# Altium project Sp25-Candle_Maker.PrjPcb (part 1 of 2)
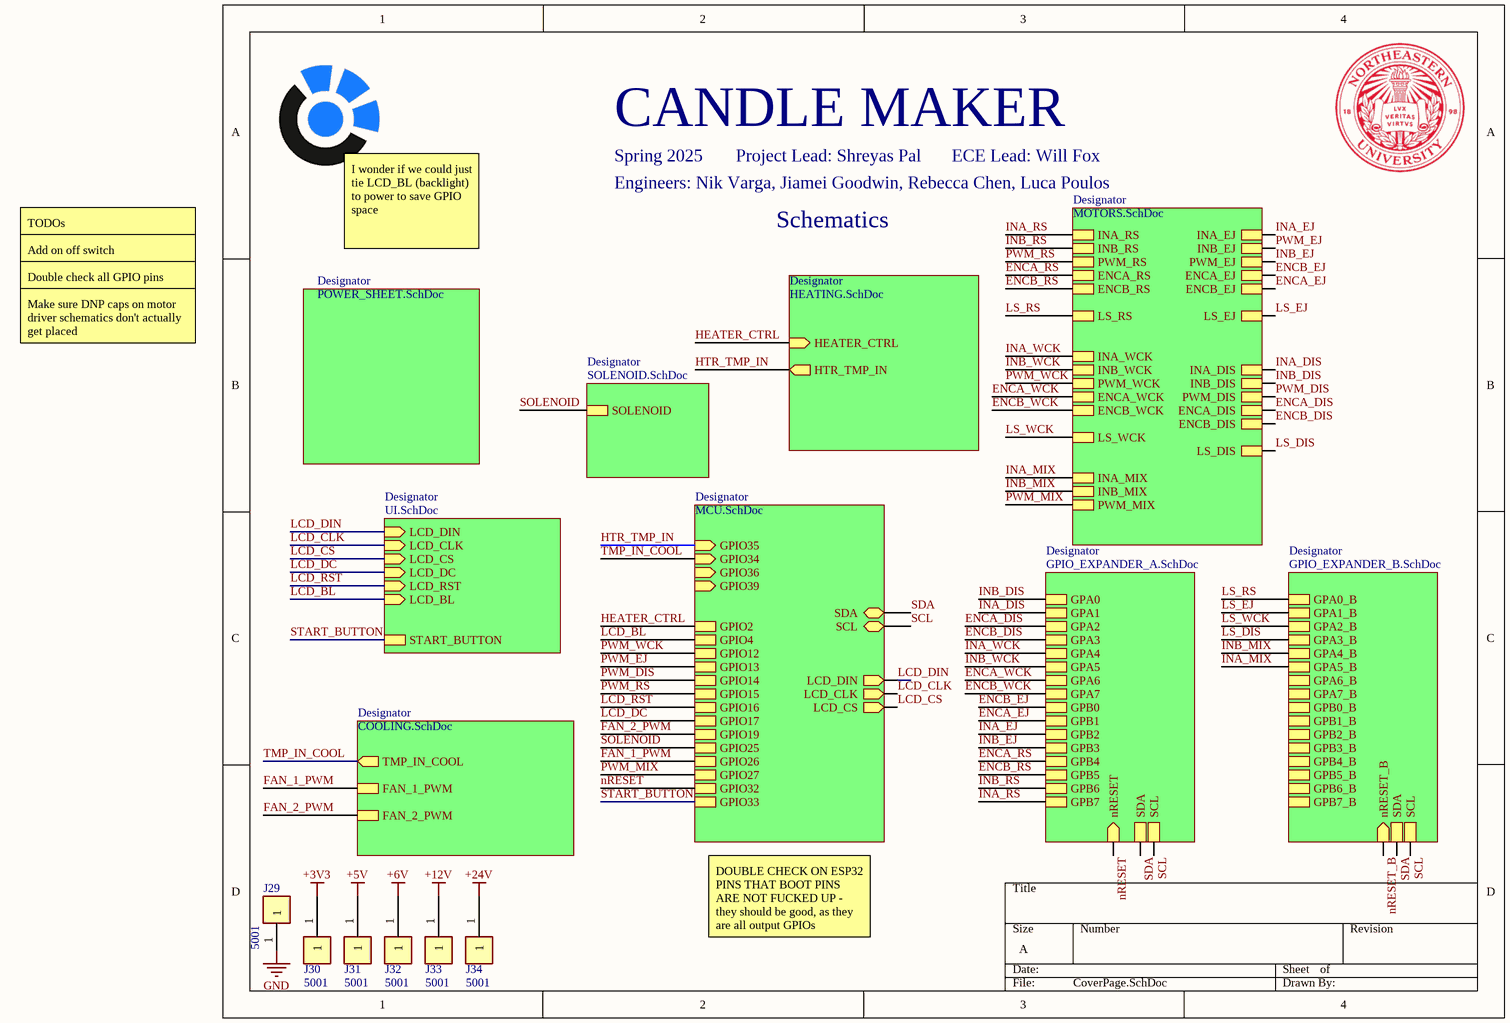
[diagram p0: CoverPage.SchDoc]
12 sheets, 196 parts. Net scope: hierarchical (ports join the sheet entries above them; power ports are global).
Board file: Candle_Main_PCB.PcbDoc
Sheets:
  CoverPage.SchDoc
    Designator = HEATING.SchDoc
    Designator = MCU.SchDoc
    Designator = MOTORS.SchDoc
      D1 = VNH5019.SchDoc
      D5 = VNH5019.SchDoc
      D4 = VNH5019.SchDoc
      D2 = VNH5019.SchDoc
      D3 = VNH5019.SchDoc
    Designator = COOLING.SchDoc
    Designator = POWER_SHEET.SchDoc
    Designator = UI.SchDoc
    Designator = GPIO_EXPANDER_A.SchDoc
    Designator = GPIO_EXPANDER_B.SchDoc
    Designator = SOLENOID.SchDoc
  LDO.SchDoc

## Sheet CoverPage.SchDoc
size A; SheetNumber: 1; SheetTotal: 12

### Parts
J29  5001  [FP-5001-MFG]
J30  5001  [FP-5001-MFG]
J31  5001  [FP-5001-MFG]
J32  5001  [FP-5001-MFG]
J33  5001  [FP-5001-MFG]
J34  5001  [FP-5001-MFG]

### Sub-sheets
Designator = HEATING.SchDoc: HEATER_CTRL (in), HTR_TMP_IN (out)
Designator = MCU.SchDoc: GPIO35 (in), SDA (bidir), SCL (bidir), LCD_DIN (out), LCD_CLK (out), LCD_CS (out), GPIO2, GPIO4, GPIO12, GPIO13, GPIO14, GPIO15, GPIO16, GPIO17, GPIO19, GPIO25, GPIO26, GPIO27, GPIO32, GPIO33, GPIO34 (in), GPIO36 (in), GPIO39 (in)
Designator = MOTORS.SchDoc: INA_RS, INB_RS, PWM_RS, ENCA_RS, ENCB_RS, LS_RS, INA_WCK, INB_WCK, PWM_WCK, ENCA_WCK, ENCB_WCK, LS_WCK, INA_MIX, INB_MIX, PWM_MIX, INA_EJ, INB_EJ, PWM_EJ, ENCA_EJ, ENCB_EJ, LS_EJ, INA_DIS, INB_DIS, PWM_DIS, ENCA_DIS, ENCB_DIS, LS_DIS
Designator = COOLING.SchDoc: TMP_IN_COOL (out), FAN_1_PWM, FAN_2_PWM
Designator = POWER_SHEET.SchDoc: no entries
Designator = UI.SchDoc: LCD_DIN (in), LCD_CLK (in), LCD_CS (in), LCD_DC (in), LCD_RST (in), LCD_BL (in), START_BUTTON
Designator = GPIO_EXPANDER_A.SchDoc: GPA0, GPA1, GPA2, GPA3, GPA4, GPA5, GPA6, GPA7, GPB0, GPB1, GPB2, GPB3, GPB4, GPB5, GPB6, GPB7, SCL, SDA, nRESET (in)
Designator = GPIO_EXPANDER_B.SchDoc: SCL, SDA, GPA0_B, GPA1_B, GPA2_B, GPA3_B, GPA4_B, GPA5_B, GPA6_B, GPA7_B, GPB0_B, GPB1_B, GPB2_B, GPB3_B, GPB4_B, GPB5_B, GPB6_B, GPB7_B, nRESET_B (in)
Designator = SOLENOID.SchDoc: SOLENOID

### Nets
+3V3: J30.1
+5V: J31.1
+6V: J32.1  [project net VOUT6]
+12V: J33.1  [project net VOUT12]
+24V: J34.1
GND: J29.1
ENCA_DIS: sheet Designator/ENCA_DIS, sheet Designator/GPA2
ENCA_EJ: sheet Designator/ENCB_EJ, sheet Designator/GPB1
ENCA_RS: sheet Designator/ENCA_RS, sheet Designator/GPB4
ENCA_WCK: sheet Designator/ENCA_WCK, sheet Designator/GPA6
ENCB_DIS: sheet Designator/ENCB_DIS, sheet Designator/GPA3
ENCB_EJ: sheet Designator/ENCA_EJ, sheet Designator/GPB0
ENCB_RS: sheet Designator/ENCB_RS, sheet Designator/GPB5
ENCB_WCK: sheet Designator/ENCB_WCK, sheet Designator/GPA7
FAN_1_PWM: sheet Designator/GPIO26, sheet Designator/FAN_1_PWM
FAN_2_PWM: sheet Designator/GPIO19, sheet Designator/FAN_2_PWM
HEATER_CTRL: sheet Designator/HEATER_CTRL, sheet Designator/GPIO2
HTR_TMP_IN: sheet Designator/HTR_TMP_IN, sheet Designator/GPIO35
INA_DIS: sheet Designator/INA_DIS, sheet Designator/GPA1
INA_EJ: sheet Designator/INA_EJ, sheet Designator/GPB2
INA_MIX: sheet Designator/INA_MIX, sheet Designator/GPA5_B
INA_RS: sheet Designator/INA_RS, sheet Designator/GPB7
INA_WCK: sheet Designator/INA_WCK, sheet Designator/GPA4
INB_DIS: sheet Designator/INB_DIS, sheet Designator/GPA0
INB_EJ: sheet Designator/PWM_EJ, sheet Designator/GPB3
INB_MIX: sheet Designator/INB_MIX, sheet Designator/GPA4_B
INB_RS: sheet Designator/INB_RS, sheet Designator/GPB6
INB_WCK: sheet Designator/INB_WCK, sheet Designator/GPA5
LCD_BL: sheet Designator/GPIO4, sheet Designator/LCD_BL
LCD_CLK: sheet Designator/LCD_CLK, sheet Designator/LCD_CLK
LCD_CS: sheet Designator/LCD_CS, sheet Designator/LCD_CS
LCD_DC: sheet Designator/GPIO17, sheet Designator/LCD_DC
LCD_DIN: sheet Designator/LCD_DIN, sheet Designator/LCD_DIN
LCD_RST: sheet Designator/GPIO16, sheet Designator/LCD_RST
LS_DIS: sheet Designator/LS_DIS, sheet Designator/GPA3_B
LS_EJ: sheet Designator/LS_EJ, sheet Designator/GPA1_B
LS_RS: sheet Designator/LS_RS, sheet Designator/GPA0_B
LS_WCK: sheet Designator/LS_WCK, sheet Designator/GPA2_B
nRESET: sheet Designator/GPIO32, sheet Designator/nRESET
nRESET_B: sheet Designator/nRESET_B
PWM_DIS: sheet Designator/GPIO14, sheet Designator/PWM_DIS
PWM_EJ: sheet Designator/GPIO13, sheet Designator/INB_EJ
PWM_MIX: sheet Designator/GPIO27, sheet Designator/PWM_MIX
PWM_RS: sheet Designator/GPIO15, sheet Designator/PWM_RS
PWM_WCK: sheet Designator/GPIO12, sheet Designator/PWM_WCK
SCL: sheet Designator/SCL, sheet Designator/SCL, sheet Designator/SCL
SDA: sheet Designator/SDA, sheet Designator/SDA, sheet Designator/SDA
SOLENOID: sheet Designator/GPIO25, sheet Designator/SOLENOID
START_BUTTON: sheet Designator/GPIO33, sheet Designator/START_BUTTON
TMP_IN_COOL: sheet Designator/GPIO34, sheet Designator/TMP_IN_COOL

### Notes on the sheet
- CANDLE MAKER
- Spring 2025
- Project Lead: Shreyas Pal
- ECE Lead: Will Fox
- TODOs
- Engineers: Nik Varga, Jiamei Goodwin, Rebecca Chen, Luca Poulos
- Schematics
- Add on off switch
- Double check all GPIO pins
- I wonder if we could just tie LCD_BL (backlight) to power to save GPIO space
- Make sure DNP caps on motor driver schematics don't actually get placed
- DOUBLE CHECK ON ESP32 PINS THAT BOOT PINS ARE NOT FUCKED UP - they should be good, as they are all output GPIOs

### Library data of the parts
J29-J34 = CMP-2000-05181-2: PC TEST POINT MINIATURE BLACK; Body Material: Bronze; Plating: Silver; Inside Diameter: 1.27mm; Hole Diameter: 1.6mm; Number of Ports: 1; Outside Diameter: 2.54mm; Insulation: Insulated; Insulation Material: Nylon; Mount: Through Hole; RoHS Compliant: Yes; Series: THM; Height: 0.3inch; Termination: Through Hole; Material: Nylon; Packaging: Bulk; Contact Material: Bronze; REACH SVHC: No SVHC; Contact Plating: Silver; Orientation: Straight; Lead Free: Lead Free; Package Quantity: 100; Length: 7.62mm; Flammability Rating: UL94 V-0; Number of Contacts: 1; Diameter: 2.54mm; Housing Color: Black; Color: Black

## Sheet HEATING.SchDoc
size A; SheetNumber: 3; SheetTotal: 12
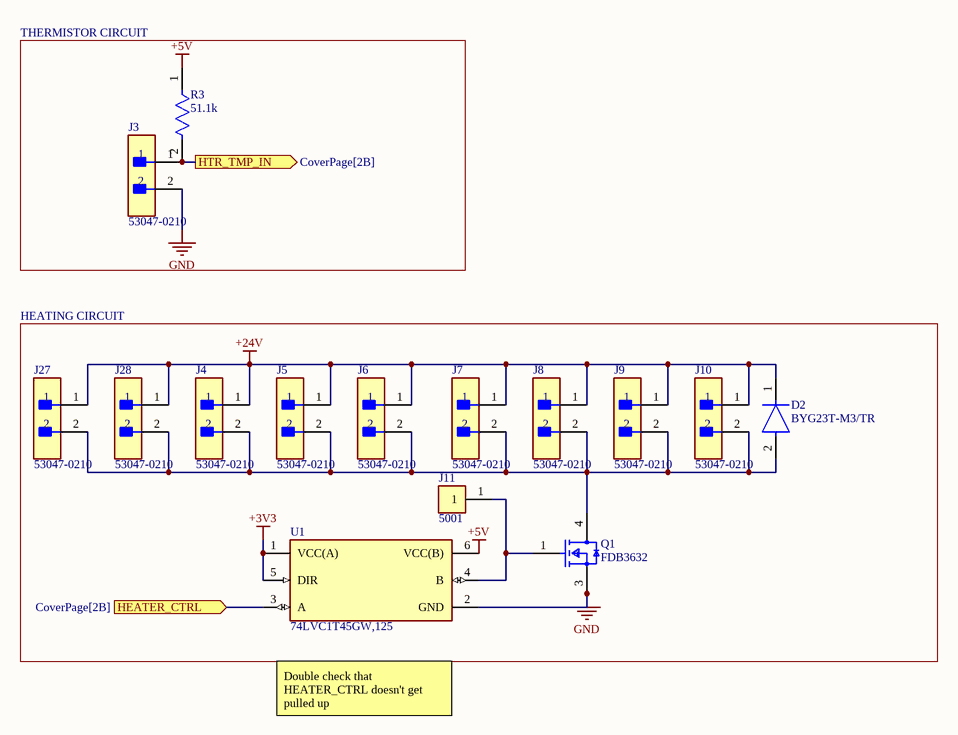
[diagram p1: HEATING.SchDoc]

### Parts
D2  BYG23T-M3/TR  [FP-SMA-MFG]
J3  53047-0210  [FP-53047-0210-MFG]
J4  53047-0210  [FP-53047-0210-MFG]
J5  53047-0210  [FP-53047-0210-MFG]
J6  53047-0210  [FP-53047-0210-MFG]
J7  53047-0210  [FP-53047-0210-MFG]
J8  53047-0210  [FP-53047-0210-MFG]
J9  53047-0210  [FP-53047-0210-MFG]
J10  53047-0210  [FP-53047-0210-MFG]
J11  5001  [FP-5001-MFG]
J27  53047-0210  [FP-53047-0210-MFG]
J28  53047-0210  [FP-53047-0210-MFG]
Q1  FDB3632  [FP-418AJ-MFG]
R3  51.1k  [FP-RG2012-MFG]
U1  74LVC1T45GW,125  [FP-SOT363-IPC_B]

### Blocks framed on the sheet
THERMISTOR CIRCUIT: J3 R3
HEATING CIRCUIT: D2 J4-J11 J27 J28 Q1 U1

### Ports
HEATER_CTRL (in, see CoverPage[2B]), HTR_TMP_IN (out, see CoverPage[2B])

### Nets
+3V3: U1.1(VCC(A)) U1.5(DIR)
+5V: R3.1 U1.6(VCC(B))
+24V: D2.1(C) J4.1 J5.1 J6.1 J7.1 J8.1 J9.1 J10.1 J27.1 J28.1
GND: J3.2 Q1.3(S) U1.2(GND)
HEATER_CTRL: U1.3(A) ; port HEATER_CTRL
HTR_TMP_IN: J3.1 R3.2 ; port HTR_TMP_IN
NetD2_2: D2.2(A) J4.2 J5.2 J6.2 J7.2 J8.2 J9.2 J10.2 J27.2 J28.2 Q1.4(D)
NetJ11_1: J11.1 Q1.1(G) U1.4(B)

### Notes on the sheet
- Double check that HEATER_CTRL doesn't get pulled up

### Library data of the parts
D2 = CMP-02540-000071-1: DIODE AVALANCHE 1300V 1A DO214AC; Element Configuration: Single; Reverse Voltage: 1.3kV; Zener Voltage: 200V; Reverse Recovery Time: 75ns; Max Forward Surge Current (Ifsm): 18A; Max Reverse Current: 5uA; Max Power Dissipation: 800mW; Forward Voltage: 1.74V; Min Operating Temperature: -55°C; Diode Type: Avalanche; Mount: Surface Mount; Series: BYG23T-M3; Radiation Hardening: No; Height: 2.29mm; Width: 2.79mm; Number of Pins: 2; Length: 4.5mm; Weight: 0.00388oz; Forward Current: 1A; Package Quantity: 1800; Recovery Time: 75ns; Peak Non-Repetitive Surge Current: 18A; Max Repetitive Reverse Voltage (Vrrm): 1.3kV; Average Rectified Current: 1A; Contact Plating: Tin; RoHS Compliant: Yes; Case/Package: SMA; Max Reverse Voltage (DC): 1.3kV; Max Operating Temperature: 150°C; Packaging: Cut Tape; Max Surge Current: 18A
J3-J10 J27 J28 = CMP-2000-05628-3: CONN HEADER VERT 2POS 1.25MM; Manufacturer: Molex; Conn Gender: Male; Voltage Rating: 125V; Conn Orientation: Vertical; Number Of Contacts: 2; Current Rating: 1A; Contact Material: Tin; Temperature Range Low: -40°C; ComponentLink2URL: http://www.molex.com/webdocs/datasheets/pdf/en-us/0530470210_PCB_HEADERS.pdf; Mouser Description: 1.25mm Pitch PicoBlade™ Wire-to-Board Header, Vertical, with Friction Lock, 2 Circuits; Manufacturer Part Number: 53047-0210; Temperature Range High: +85°C; ComponentLink2Description: Datasheet; Automotive: No; RoHS: TRUE; Ambient Temperature Range High: +85°C; Octopart: https://octopart.com/53047-0210-molex-276772; Footprint Url: https://www.molex.com/pdm_docs/sd/530470210_sd.pdf; Lead Free: Yes; Pitch: 1.25mm; Temperature: -40°C to +85°C; Device Class L2: Headers and Wire Housings; Package: 0; Ambient Temperature Range Low: -40°C; Digikey Description: CONN HEADER VERT 2POS 1.25MM; Category: Conn; Device Class L3: unset; Number Of Rows: 1; Device Class L1: Connectors; Height: 4.4mm
J11 = CMP-2000-05181-2: as J29 on sheet CoverPage; Insulation Material: Nylon; Mount: Through Hole; RoHS Compliant: Yes; Series: THM; Height: 0.3inch; Termination: Through Hole; Material: Nylon; Packaging: Bulk; Contact Material: Bronze; REACH SVHC: No SVHC; Contact Plating: Silver; Orientation: Straight; Lead Free: Lead Free; Package Quantity: 100; Length: 7.62mm; Flammability Rating: UL94 V-0; Number of Contacts: 1; Diameter: 2.54mm; Housing Color: Black; Color: Black
Q1 = CMP-07173-000068-1: MOSFET N-CH 100V 80A D2PAK; Manufacturer: ON Semiconductor; Threshold Vgs Min: 2V; Turn On Delay Time: 30ns; Reverse Recovery Charge: 120nC; Input Capacitace At Vds: 6000pF @ 25V; Max Junction Temp: +175°C; Threshold Vgs Max: 4V; Number Of Channels: 1; Drain To Source Resistance: 0.0075Ω; Power Dissipation: 310W; Reverse Recovery Time: 64ns; Rthja Max: 43°C/W; Continuous Drain Current: 12A; Depletion Mode: False; Standoff Height: 0mm; Gate To Source Voltage: 20V; Turn Off Delay Time: 96ns; Gate Charge At Vgs: 84nC @ 10V; Max Forward Diode Voltage: 1.25V; Footprint Url: https://www.onsemi.com/pub/Collateral/418AJ.PDF; Category: Trans; ComponentLink2URL: https://www.onsemi.com/pub/Collateral/FDP3632-D.PDF; Package: 418AJ; Drain To Source Voltage: 100V; ComponentLink2Description: Datasheet; Temperature Range Low: -55°C; Device Class L2: Transistors; Digikey Description: MOSFET N-CH 100V 80A D2PAK; Device Class L3: MOSFETs; Automotive: No; Drain To Source Breakdown Voltage: 100V; Octopart: https://octopart.com/fdb3632-on+semiconductor-84325670; Number Of N Channels: 1; Temperature Range High: +175°C; Device Class L1: Discrete Semiconductors; RoHS: TRUE; Lead Free: Yes; Height: 5.08mm; Manufacturer Part Number: FDB3632; Mouser Description: MOSFET N-Channel PowerTrench; Temperature: -55°C to +175°C
R3 = CMP-2001-03008-2: Automotive Metal Thin Film Chip Resistor, 0805, 51.1kΩ, 0.1%, 25ppm/°C, 0.125W, 150V; Power Rating: 125mW; Resistance: 51.1kR; Number of Terminations: 2; Case Code (Imperial): 0805; Height: 0.02inch; Min Operating Temperature: -55°C; Voltage Rating: 150V; Length: 0.079inch; Lead Free: Lead Free; Resistor Type: Thin Film; Tolerance: 0.1%; Weight: 0.000194oz; Termination: SMD/SMT; Max Power Dissipation: 125mW; Packaging: Tape and Reel; Width: 1.2mm; Series: RG; Max Operating Temperature: 155°C; Case/Package: 0805; Temperature Coefficient: 25ppm/°C; Package Quantity: 1; Case Code (Metric): 2012; RoHS Compliant: Yes; Voltage Rating (DC): 150V; Features: Automotive AEC-Q200
U1 = CMP-14347-000008-1: IC TRNSLTR BIDIRECTIONAL 6TSSOP

## Sheet MCU.SchDoc
size 381 x 241 mm; SheetNumber: 4; SheetTotal: 12
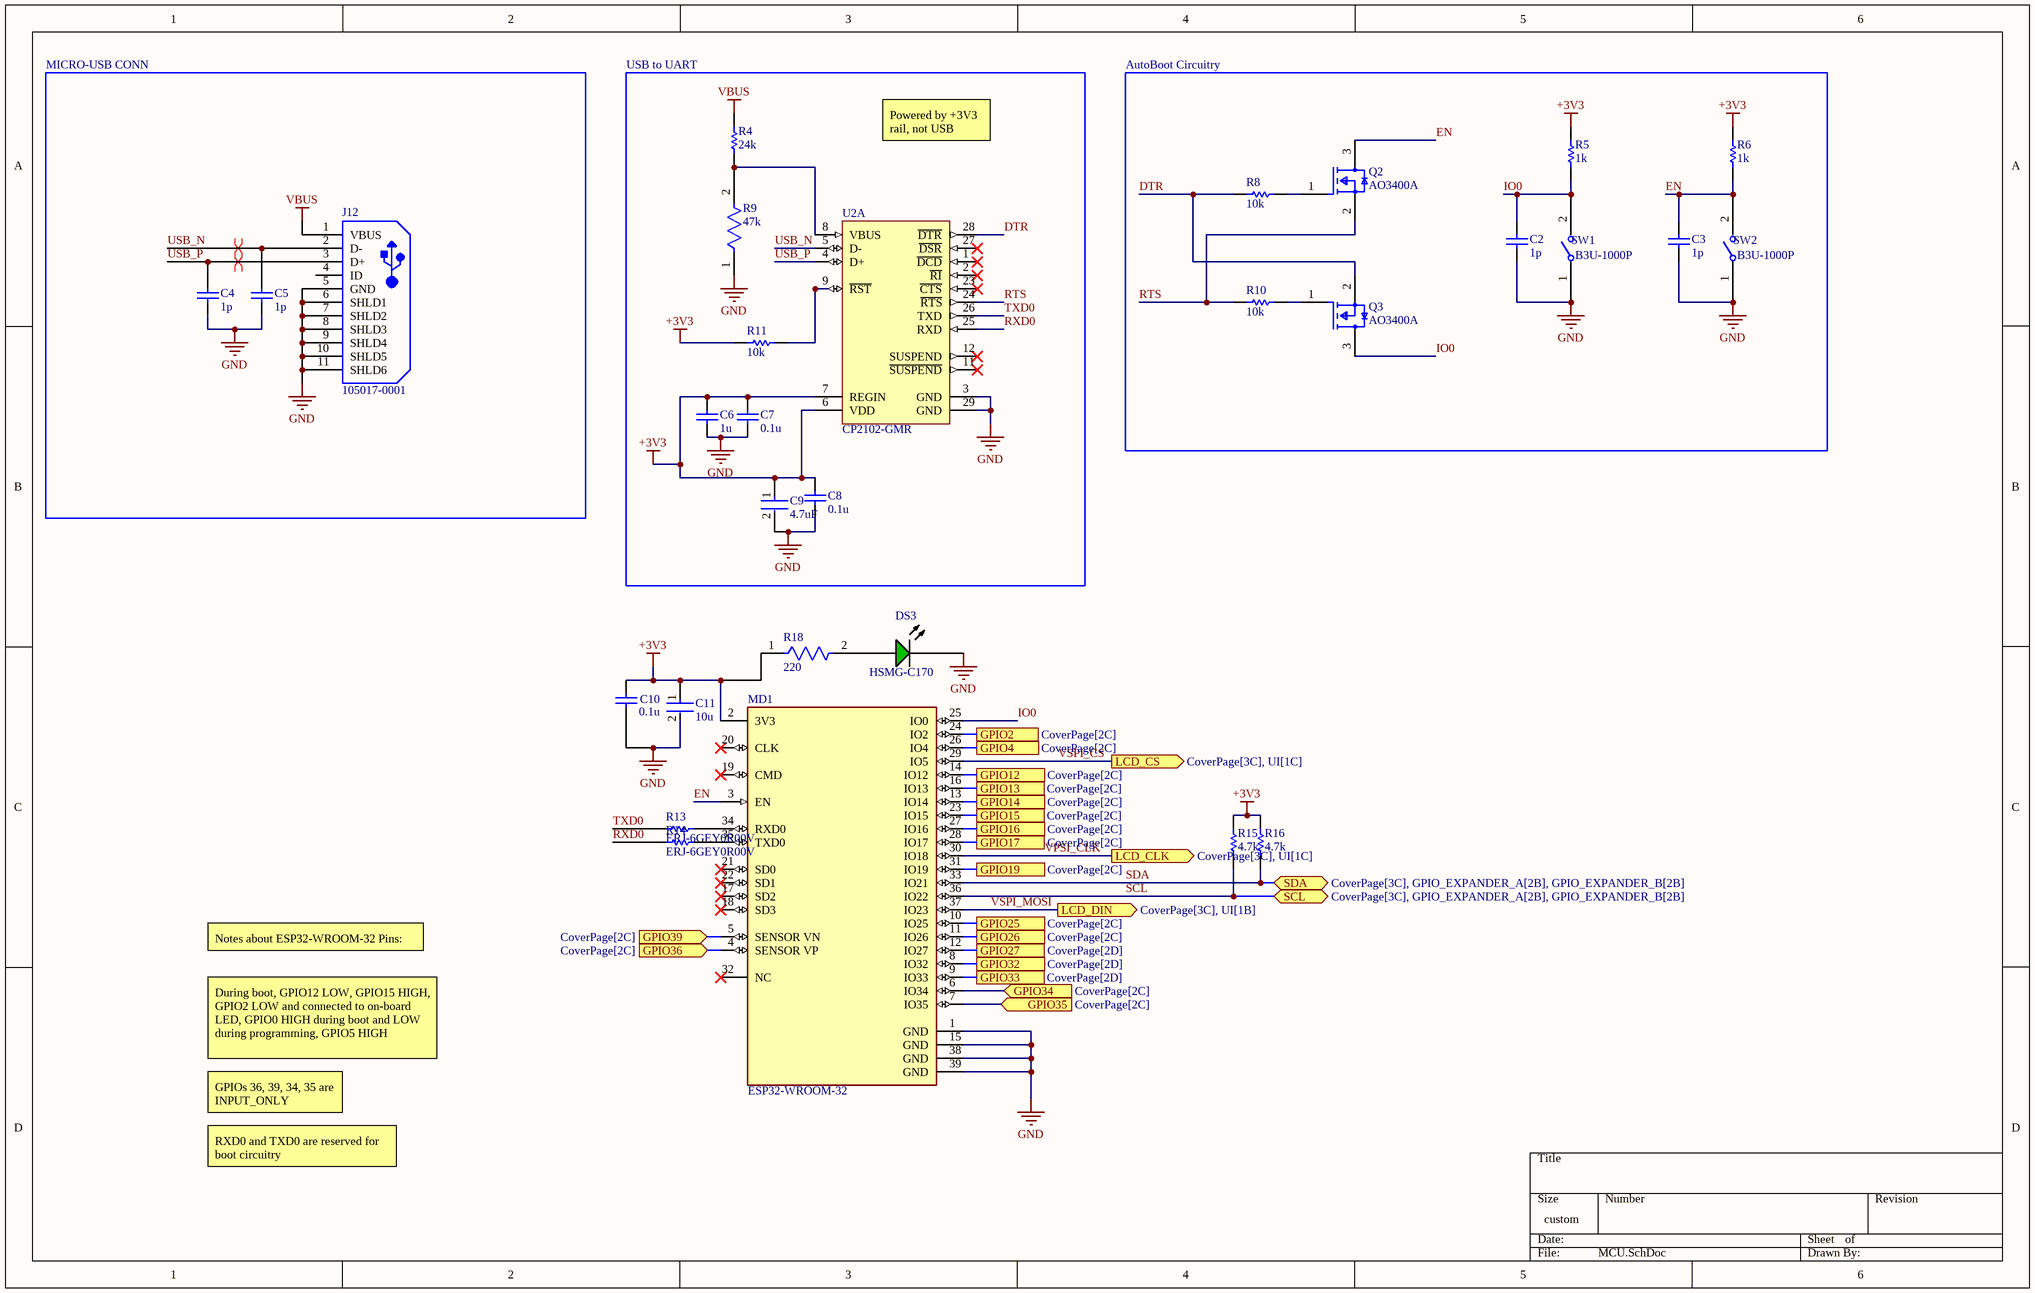
[diagram p2: MCU.SchDoc]

### Parts
C2  1p  [CAPC2013X140X50LL20T25]
C3  1p  [CAPC2013X140X50LL20T25]
C4  1p  [CAPC2013X140X50LL20T25]
C5  1p  [CAPC2013X140X50LL20T25]
C6  1u  [CAPC2013X145X50LL20T25]
C7  0.1u  [CAPC2013X94X50LL20T25]
C8  0.1u  [CAPC2013X94X50LL20T25]
C9  4.7uF  [FP-CL21-IPC_A]
C10  0.1u  [CAPC2013X94X50LL20T25]
C11  10u  [FP-C0805C-DG-MFG]
DS3  HSMG-C170  [AVAG-HSMX-C170_V]
J12  105017-0001  [USB-MICRO-B_V]
MD1  ESP32-WROOM-32  [FP-ESP32-WROOM-32-MFG]
Q2  AO3400A  [FP-SOT23-MFG]
Q3  AO3400A  [FP-SOT23-MFG]
R4  24k  [RESC2013X60X40LL20T25]
R5  1k  [RESC2013X60X35ML10T20]
R6  1k  [RESC2013X60X35ML10T20]
R8  10k  [RESC2013X60X40LL20T25_A]
R9  47k  [FP-ERA6A-MFG]
R10  10k  [RESC2013X60X40LL20T25_A]
R11  10k  [RESC2013X60X40LL20T25_A]
R13  ERJ-6GEY0R00V  [RESC2013X70X40NL20T20]
R14  ERJ-6GEY0R00V  [RESC2013X70X40NL20T20]
R15  4.7k  [YAGO-RC0805_M]
R16  4.7k  [YAGO-RC0805_M]
R18  220  [FP-CRCW0805-e3-MFG]
SW1  B3U-1000P  [FP-B3U-1000P-MFG]
SW2  B3U-1000P  [FP-B3U-1000P-MFG]
U2  CP2102-GMR  [SLAB-QFN-28-3125x3125TP_M]  (part A of 2)

### Blocks framed on the sheet
MICRO-USB CONN: C4 C5 J12
USB to UART: C6-C9 R4 R9 R11 U2
AutoBoot Circuitry: C2 C3 Q2 Q3 R5 R6 R8 R10 SW1 SW2

### Ports
GPIO2 (see CoverPage[2C]), GPIO4 (see CoverPage[2C]), GPIO12 (see CoverPage[2C]), GPIO13 (see CoverPage[2C]), GPIO14 (see CoverPage[2C]), GPIO15 (see CoverPage[2C]), GPIO16 (see CoverPage[2C]), GPIO17 (see CoverPage[2C]), GPIO19 (see CoverPage[2C]), GPIO25 (see CoverPage[2C]), GPIO26 (see CoverPage[2C]), GPIO27 (see CoverPage[2D]), GPIO32 (see CoverPage[2D]), GPIO33 (see CoverPage[2D]), GPIO34 (in, see CoverPage[2C]), GPIO35 (in, see CoverPage[2C]), GPIO36 (in, see CoverPage[2C]), GPIO39 (in, see CoverPage[2C]), LCD_CLK (out, see CoverPage[3C], UI[1C]), LCD_CS (out, see CoverPage[3C], UI[1C]), LCD_DIN (out, see CoverPage[3C], UI[1B]), SCL (bidir, see CoverPage[3C], GPIO_EXPANDER_A[2B], GPIO_EXPANDER_B[2B]), SDA (bidir, see CoverPage[3C], GPIO_EXPANDER_A[2B], GPIO_EXPANDER_B[2B])

### Nets
+3V3: C6.2 C7.2 C8.2 C9.1 C10.2 C11.1 MD1.2(3V3) R5.2 R6.2 R11.1 R15.2 R16.2 R18.1 U2.6(VDD) U2.7(REGIN)
GND: C2.1 C3.1 C4.1 C5.1 C6.1 C7.1 C8.1 C9.2 C10.1 C11.2 DS3.2(K) J12.5(GND) J12.6(SHLD1) J12.7(SHLD2) J12.8(SHLD3) J12.9(SHLD4) J12.10(SHLD5) J12.11(SHLD6) MD1.1(GND) MD1.15(GND) MD1.38(GND) MD1.39(GND) R9.1 SW1.1 SW2.1 U2.3(GND) U2.29(GND)
VBUS: J12.1(VBUS) R4.2
DTR: Q3.2(S) R8.1 U2.28(~{DTR})
EN: C3.2 MD1.3(EN) Q2.3(D) R6.1 SW2.2
FAN_1_PWM: MD1.11(IO26) ; port GPIO26
FAN_2_PWM: MD1.31(IO19) ; port GPIO19
HEATER_CTRL: MD1.24(IO2) ; port GPIO2
HTR_TMP_IN: MD1.7(IO35) ; port GPIO35
IO0: C2.2 MD1.25(IO0) Q3.3(D) R5.1 SW1.2
LCD_BL: MD1.26(IO4) ; port GPIO4
LCD_DC: MD1.28(IO17) ; port GPIO17
LCD_RST: MD1.27(IO16) ; port GPIO16
nRESET: MD1.8(IO32) ; port GPIO32
PWM_DIS: MD1.13(IO14) ; port GPIO14
PWM_EJ: MD1.16(IO13) ; port GPIO13
PWM_MIX: MD1.12(IO27) ; port GPIO27
PWM_RS: MD1.23(IO15) ; port GPIO15
PWM_WCK: MD1.14(IO12) ; port GPIO12
RTS: Q2.2(S) R10.1 U2.24(~{RTS})
RXD0: R14.1 U2.25(RXD)
SCL: MD1.36(IO22) R15.1 ; port SCL
SDA: MD1.33(IO21) R16.1 ; port SDA
SOLENOID: MD1.10(IO25) ; port GPIO25
START_BUTTON: MD1.9(IO33) ; port GPIO33
TMP_IN_COOL: MD1.6(IO34) ; port GPIO34
TXD0: R13.1 U2.26(TXD)
USB_N: C5.2 J12.2(D-) U2.5(D-)
USB_P: C4.2 J12.3(D+) U2.4(D+)
VPSI_CLK: MD1.30(IO18) ; port LCD_CLK  [project net LCD_CLK]
VSPI_CS: MD1.29(IO5) ; port LCD_CS  [project net LCD_CS]
VSPI_MOSI: MD1.37(IO23) ; port LCD_DIN  [project net LCD_DIN]
NetDS3_1: DS3.1(A) R18.2
NetMD1_4: MD1.4(SENSOR_VP) ; port GPIO36
NetMD1_5: MD1.5(SENSOR_VN) ; port GPIO39
NetMD1_34: MD1.34(RXD0) R13.2
NetMD1_35: MD1.35(TXD0) R14.2
NetQ2_1: Q2.1(G) R8.2
NetQ3_1: Q3.1(G) R10.2
NetR4_1: R4.1 R9.2 U2.8(VBUS)
NetR11_2: R11.2 U2.9(~{RST})

Not connected (* = marked no-connect by the designer): J12 4(ID); MD1 17(SD2)* 18(SD3)* 19(CMD)* 20(CLK)* 21(SD0)* 22(SD1)* 32(NC)*; U2 1(~{DCD})* 2(~{RI})* 11(~{SUSPEND})* 12(SUSPEND)* 23(~{CTS})* 27(~{DSR})*

### Layout directives
differential pair: USB_N, USB_P

### Notes on the sheet
- Powered by +3V3 rail, not USB
- Notes about ESP32-WROOM-32 Pins:
- During boot, GPIO12 LOW, GPIO15 HIGH, GPIO2 LOW and connected to on-board LED, GPIO0 HIGH during boot and LOW during programming, GPIO5 HIGH
- GPIOs 36, 39, 34, 35 are INPUT_ONLY
- RXD0 and TXD0 are reserved for boot circuitry

### Library data of the parts
C2-C5 = CMP-1036-00067-2: Part Number: 08055A1R0CAT2A; Manufacturer: AVX Interconnect / Elco
C6 = CMP-1036-04746-2: Manufacturer: Kemet; Part Number: C0805C105K4PACTU
C7 C8 C10 = CMP-2007-04369-1: Manufacturer: AVX Interconnect / Elco; Part Number: 08055C104JAZ2A
C9 = CMP-13271-002624-1: CL21 Series 0805 4.7uF 25V ±10% Tolerance X5R Multilayer Ceramic Chip Capacitor; Case Code (Imperial): 0805; Thickness: 0.055inch; Mount: Surface Mount; Case Code (Metric): 2012; Capacitance: 4.7uF; Depth: 1.25mm; Lead Free: Lead Free; Case/Package: 0805; Voltage Rating: 25V; Package Quantity: 1; Width: 0.049inch; Radiation Hardening: No; Voltage Rating (DC): 25V; Length: 2mm; Dielectric: X5R; Height: 1.25mm; Packaging: Tape and Reel; Tolerance: 10%; Min Operating Temperature: -55°C; Max Operating Temperature: 85°C
C11 = CMP-2007-03243-2: CAP CER 10UF 10V X5R 0805; Manufacturer Part Number: C0805C106K8PACTU; Manufacturer: Kemet; 3DS Part Number: 220-00001; Tolerance: 10%; Temperature Coefficient: 15%; Material: Ceramic; Device Class L2: Capacitors; Device Class L1: Passive Components; ComponentLink2URL: https://content.kemet.com/datasheets/KEM_C1006_X5R_SMD.pdf; Height: 1.4mm; Lead Free: Yes; Digikey Description: CAP CER 10UF 10V X5R 0805; Octopart: https://octopart.com/c0805c106k8pactu-kemet-98697; Capacitance: 10uF; Value: 10uF; Temperature Range Low: -55°C; Temperature: -55°C to +85°C; Automotive: No; Mouser Description: CAP CER 10UF 10V X5R 0805; Ipc Land Pattern Name: CAPC200125X125; Temperature Range High: +85°C; Voltage: 10V; RoHS: TRUE; Device Class L3: Ceramic Capacitors; ComponentLink2Description: Datasheet; Voltage Rating: 10V; Package: C0805C-DG; Temperature Characteristic: X5R; Category: Cap
DS3 = CMP-2000-05062-1: Chip LED, Green, 2.2 V, -40 to 85 degC, 2-Pin SMD, Pb-Free, Tape and Reel; Manufacturer: Avago; No. of Pins: 2; Peak Wavelength: 570nm; SVHC: NoSVHC(16-Jun-2014); Dominant Wavelength: 572nm; Forward Current If: 20mA; Viewing Angle: 170deg; Lens Shape: Rectangular; PIV Max: 5V; External Width: 1.25mm; LED Type: Standard; External Depth: 0.8mm; Opto Mounting Orientation: Top; Luminous Intensity: 15mcd; Luminous Intensity Min: 4mcd; Forward Voltage VF Max: 2.6V; External Length / Height: 2mm; Bulb Size: 1.25mmx1.4mm; Light Area Height: 1mm; Voltage Vf Typ: 2.2V; Operating Temperature Max: 85degC; Datasheet Version: Oct-08; MSL: MSL2A-4weeks; Peak Forward Current: 20mA; Package Description: 2-Pin Surface Mount Device, Body 2 x 1.25 mm, Height 0.8 mm; Datasheet URL: https://datasheet.ciiva.com/29280/180495-da-01-en-chip-led-hsmg-c170-gelb-gruen-29280971.pdf; Storage Temperature Min: -40degC; LED Colour: Green; Wavelength Typ: 570nm; Mounting Type: SMD; Forward Current If Max: 20mA; Dominant Wavelength Typ: 572nm; LED Mounting: SMD; Operating Temperature Range: -30degCto+85degC; Operating Temperature Min: -30degC; Manufacturer URL: http://www.avagotech.com/; Packaging: CutTape; Luminous Intensity Typ: 15mcd; Package Reference: HSMX-C170; Storage Temperature Max: 85degC; Opto Case Style: SMD; Forward Voltage: 2.2V
J12 = CMP-2000-05827-1: Micro-USB B Receptacle, Right Angle, Bottom Mount, Surface Mount, with Solder Tabs, -30 to 85 degC, 5-Pin USB, RoHS, Tape and Reel; Manufacturer: Molex; Featured Product: Micro-USBConnectorsUSBConnectors; Other Names: WM1399DKR; Package Version: Rev. F, 12/2012; Number of Contacts: 5; Connector Type: USB-microB; Catalog Drawings: 1050170001; 3D Model: 105017-0001.stp; Mating Products: WM17145-ND-CABLEMICROUSBBTOSTDA1.0MWM17147-ND-CABLEMICROUSBBTOSTDA2.0MWM17146-ND-CABLEMICROUSBBTOSTDA1.5M; PCN Assembly/Origin: ResinSupplier21/Oct/2015; Voltage - Max: 30V; Online Catalog: Molex-MicroUSB; Manufacturer URL: http://www.molex.com/; Package Description: 5-Leads USB, Micro B, Body 7.5 x 5 mm, Pitch 0.65 mm; Datasheet URL: http://www.molex.com/elqNow/elqRedir.htm?ref=http://www.molex.com/webdocs/datasheets/pdf/en-us/1050170001_IO_CONNECTORS.pdf; Ingress Protection: -; Datasheet Version: 03/2016; Mounting Type: BoardCutout,SurfaceMount,RightAngle; Circuits: 5; Standard Package: 1; Package Reference: MICRO-B; Package URL: http://www.molex.com/pdm_docs/sd/1050170001_sd.pdf; Category: Connectors,Interconnects; Series: -; RoHS Information: 1050170001CertofCompliance; Features: Shielded,SolderRetention; Family: USB,DVI,HDMIConnectors; Specifications: -; Gender: Receptacle; Packaging: Digi-Reel®; Mounting Technology: SurfaceMount
MD1 = CMP-194065-000008-1: RX TXRX MOD WIFI SURFACE MOUNT; Frequency: 2.5GHz; Sensitivity: -98dBm; Operating Supply Voltage: 3.6V; Data Rate: 150Mbps; Weight: 0.088185oz; Package Quantity: 550; Min Operating Temperature: -40°C; Mount: Surface Mount; Max Operating Temperature: 85°C; Packaging: Cut Tape; Case/Package: SMD/SMT
Q2 Q3 = CMP-83955-000006-1: MOSFET N-CH 30V 5.7A SOT23; Input Capacitance: 630pF; Number of Elements: 1; Rds On Max: 26.5mR; Max Power Dissipation: 1.4W; Gate to Source Voltage (Vgs): 12V; Min Operating Temperature: -55°C; Lead Free: Lead Free; Number of Pins: 3; Drain to Source Voltage (Vdss): 30V; Case/Package: SOT-23; Mount: Surface Mount; Continuous Drain Current (ID): 5.7A; Radiation Hardening: No; Packaging: Tape and Reel; Max Operating Temperature: 150°C; Power Dissipation: 1.4W
R4 = CMP-2001-00618-1: Part Number: ERA6AEB243V; Manufacturer: Panasonic
R5 R6 = CMP-2100-03671-1: Chip Resistor, 1 KOhm, +/- 1%, 125 mW, -55 to 155 degC, 0805 (2012 Metric), RoHS, Tape and Reel; Manufacturer: Yageo; Temperature Coefficient: 100ppm/degreesC; Voltage Rating (DC): 150V; Max Power Dissipation: 125mW; Resistance: 1KOhm; Number of Pins: 2; Number of Terminations: 2; Datasheet URL: http://www.yageo.com/NewPortal/yageodocoutput?fileName=/pdf/R-Chip/PYu-RC_Group_51_RoHS_L_5.pdf; Length: 0.079inch; Package Description: 2-Pin Surface Mounted Device, Body 2 x 1.25 mm; Depth: 1.25mm; Height: 0.024inch; Military Standard: Not; Case/Package: 0805; Package Reference: 0805; RoHSCompliant: true; Lead Free: LeadFree; Packaging: TapeandReel; Package Quantity: 1; Datasheet Version: Rev. 5, 10/2016; Tolerance: 1%; Min Operating Temperature: -55degC; Voltage Rating: 150V; Composition: ThickFilm; Case Code (Imperial): 0805; Power Rating: 125mW; Width: 0.049inch; Case Code (Metric): 2012; Manufacturer URL: http://www.yageo.com/; Max Operating Temperature: 155degC; REACH SVHC: Unknown; Termination: SMD/SMT
R8 R10 R11 = CMP-2001-00582-2: Metal Film Chip Resistor, High Reliability Type, 0.125 W, +/- 0.1%, -55 to 155 degC, 0805 (2012 Metric), RoHS, Tape and Reel; Voltage Rating: 100V; Power Rating: 125mW(1/8W); Brand: Panasonic; Temperature Coefficient: 25PPM/C; Resistance: 10kOhms; Product Category: ThinFilmResistors-SMD; Datasheet Version: 02/2016; Operating Temperature Range: -55Cto+155C; Length: 2mm; Mounting Technology: SurfaceMount; Manufacturer URL: http://www.panasonic.com/; Width: 1.25mm; Packaging: Reel; Product: ThinFilmResistorsSMD; Package / Case: 0805(2012metric); Termination Style: SMD/SMT; Tolerance: 0.1%; Datasheet URL: https://industrial.panasonic.com/cdbs/www-data/pdf/RDM0000/AOA0000C307.pdf; Package Description: 2-Pin Surface Mount Device, Body 2 x 1.25 mm; Factory Pack Quantity: 5000; Series: ERA-6A; Case Code - mm: 2012; RoHS: Details; Package Reference: 0805; Height: 0.5mm; Manufacturer: Panasonic; Case Code - in: 0805; Type: MetalFilmChipResistors
R9 = CMP-2001-00645-2: NexarPartId: 1264112; Voltage Rating (DC): 100V; Max Power Dissipation: 125mW; Resistance: 47kΩ; Temperature Coefficient: 25ppm/°C; Tolerance: 0.1%; Case Code (Metric): 2012; Packaging: Cut Tape; Number of Terminations: 2; Max Operating Temperature: 155°C; Height: 500µm; Number of Pins: 2; Min Operating Temperature: -55°C; RoHS: Compliant; Features: Automotive AEC-Q200; Schedule B: 8533210045, 8533210045; Contact Plating: Tin; Case Code (Imperial): 0805; Lead Free: Lead Free; Lifecycle Status: Production; Termination: SMD/SMT; Weight: 5.499807mg; REACH SVHC: No SVHC; Voltage Rating: 100V; Mount: Surface Mount; Radiation Hardening: No; Military Standard: Not; Power Rating: 125mW; Length: 2mm; Depth: 1.25mm; Width: 1.25mm; Composition: Metal Film, Thin Film; Case/Package: 0805
R13 R14 = CMP-1665-00002-5: Chip Resistor, 0 Ohm, +/- 1%, 0.125 W, -55 to 155 degC, 0805 (2012 Metric), RoHS, Tape and Reel; Tolerance: 5%; Resistance: 0 Ohm; REACH SVHC: No SVHC; Min Operating Temperature: -55 degC; Case/Package: 0805; Packaging: Tape and Reel; Package Quantity: 5000; ComponentLink1Description: Manufacturer URL; PackageDescription: 2-Pin Surface Mount Device, Body 2 x 1.25 mm; Mounting Technology: Surface Mount; Max Operating Temperature: 155 degC; PartNumber: ERJ-6GEY0R00V; Width: 1.25 mm; RoHSCompliant: True; Height: 0.6 mm; ComponentLink1URL: http://www.panasonic.com/; ComponentLink2URL: http://industrial.panasonic.com/cdbs/www-data/pdf/RDA0000/AOA0000C84.pdf; Case Code (Imperial): 0805; DatasheetVersion: 03/2015; Length: 2 mm; Case Code (Metric): 2012; ComponentLink2Description: Datasheet; Radiation Hardening: No
R15 R16 = CMP-1568-00001-1: General Puprose Chip Resistor, 4700 Ohm +/- 1%, 0.125 W, -55 to 155 degC, 2-Pin SMD, RoHS, Tape and Reel; PartNumber: RC0805FR-074K7L; Tolerance: +/- 1%; Power: 0.125 W; PackageDescription: 2-Pin Surface Mount Device, Body 2 x 1.25 mm; ComponentLink2URL: http://www.yageo.com/documents/recent/PYu-RC_Group_51_RoHS_L-3.pdf; Temperature Min: -55 degC; Packing: Tape and Reel; Mounting Technology: Surface Mount; ComponentLink1URL: http://www.yageo.com/NewPortal/_en/index.jsp; Resistance: 4700 Ohm; Temperature Max: 155 degC; ComponentLink2Description: Datasheet; DatasheetVersion: Rev. 3; RoHS: TRUE; ComponentLink1Description: Manufacturer URL
R18 = CMP-2001-03823-2: RES Thick Film, 330Ω, 1%, 0.125W, 100ppm/°C, 0805; Voltage Rating (DC): 150V; Resistance: 330R; Max Power Dissipation: 125mW; Mount: Surface Mount; Packaging: Tape and Reel; Min Operating Temperature: -55°C; Military Standard: Not; Case Code (Metric): 2012; Height: 0.02inch; Voltage Rating: 150V; Case/Package: 0805; Max Operating Temperature: 155°C; Width: 0.049inch; Case Code (Imperial): 0805; Termination: SMD/SMT; Lead Free: Lead Free; Contact Plating: Tin; Package Quantity: 10; Composition: Thick Film; Length: 2mm; Features: Automotive AEC-Q200; Depth: 1.25mm; Weight: 0.000194oz; Tolerance: 1%; Power Rating: 125mW; Number of Terminations: 2; Temperature Coefficient: 100ppm/°C
SW1 SW2 = CMP-2100-03586-2: SWITCH TACTILE SPST-NO 0.05A 12V; Contact Resistance: 100mR; Operating Force: 1.5N; Max Current Rating: 50mA; Switch Travel: 0.15mm; Actuator Type: Standard; Mechanical Life: 200000Cycles; Ratings: Dust Proof; Illumination Type: Non-Illuminated; Throw Configuration: SPST; Actuator Length: 0.4mm; Switch Function: Off-Mom; Height: 1.2mm; Width: 3mm; Weight: 0.000776oz; Contact Material: Silver; Max Voltage Rating (DC): 12V; Insulation Resistance: 100MR; Lead Free: Lead Free; Current Rating: 50mA; Termination: SMD/SMT; Length: 4mm; Voltage Rating (DC): 12V; Contact Current Rating: 50mA; Orientation: Straight; Depth: 2.5mm; Max Operating Temperature: 70°C; Packaging: Tape and Reel; Min Operating Temperature: -25°C; Package Quantity: 1; Mount: Surface Mount; Electrical Life: 200000Cycles
U2 = CMP-2000-04924-1: Single-Chip USB to URAT Bridge, 3.3 V, -40 to 85 degC, 28-Pin QFN, RoHS, Tape and Reel; Manufacturer: Silicon Labs; Interface Circuit Standard 1: RS-232; Transmitter and Receiver FIFO Counter: No; Supply Current: 26mA; Operating Supply Voltage (Min): 3V; Operating Supply Voltage (Typ): 3.3V; Data Rate: 1000kbps; Operating Supply Voltage (Max): 3.6V; Number of Channels: 1; Package URL: http://www.silabs.com/Support%20Documents/TechnicalDocs/C8051T61x.pdf; Operating Temperature (Max): 85C; Datasheet URL: http://www.mouser.com/ds/2/368/CP2102-9-247052.pdf; Operating Temperature Classification: Industrial; Operating Temperature (Min): -40C; Package Description: 28-Pin Quad-Flat No-Leads Package, Body 5 x 5 mm, Pitch 0.5 mm; Manufacturer URL: http://www.silabs.com/; Rad Hardened: No; Package Reference: QFN-28; Pin Count: 28; Packaging: TapeandReel; Mounting: SurfaceMount; Package Type: QFNEP; Datasheet Version: Rev. 1.6, 12/2013

## Sheet MOTORS.SchDoc
size A; SheetNumber: 6; SheetTotal: 12
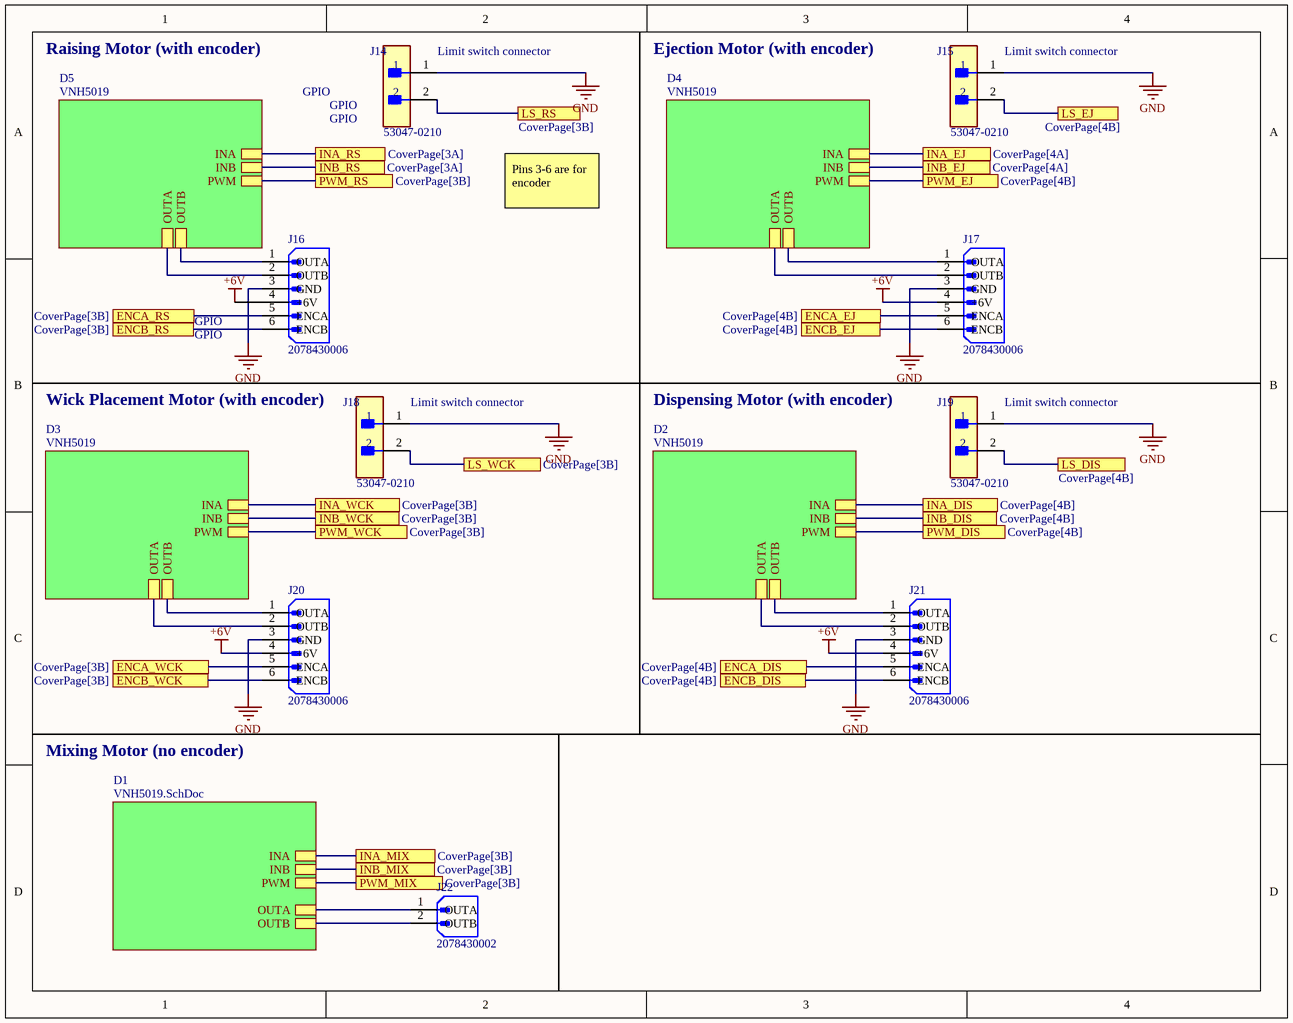
[diagram p3: MOTORS.SchDoc]

### Parts
J14  53047-0210  [FP-53047-0210-MFG]
J15  53047-0210  [FP-53047-0210-MFG]
J16  2078430006  [MOLEX_2078430006]
J17  2078430006  [MOLEX_2078430006]
J18  53047-0210  [FP-53047-0210-MFG]
J19  53047-0210  [FP-53047-0210-MFG]
J20  2078430006  [MOLEX_2078430006]
J21  2078430006  [MOLEX_2078430006]
J22  2078430002  [MOLEX_2078430002]

### Sub-sheets
D1 = VNH5019.SchDoc: INB, PWM, INA, OUTA, OUTB
D2 = VNH5019: INB, PWM, INA, OUTA, OUTB
D3 = VNH5019: INB, PWM, INA, OUTA, OUTB
D4 = VNH5019: INB, PWM, INA, OUTA, OUTB
D5 = VNH5019: OUTA, OUTB, PWM, INA, INB

### Ports
ENCA_DIS (see CoverPage[4B]), ENCA_EJ (see CoverPage[4B]), ENCA_RS (see CoverPage[3B]), ENCA_WCK (see CoverPage[3B]), ENCB_DIS (see CoverPage[4B]), ENCB_EJ (see CoverPage[4B]), ENCB_RS (see CoverPage[3B]), ENCB_WCK (see CoverPage[3B]), INA_DIS (see CoverPage[4B]), INA_EJ (see CoverPage[4A]), INA_MIX (see CoverPage[3B]), INA_RS (see CoverPage[3A]), INA_WCK (see CoverPage[3B]), INB_DIS (see CoverPage[4B]), INB_EJ (see CoverPage[4A]), INB_MIX (see CoverPage[3B]), INB_RS (see CoverPage[3A]), INB_WCK (see CoverPage[3B]), LS_DIS (see CoverPage[4B]), LS_EJ (see CoverPage[4B]), LS_RS (see CoverPage[3B]), LS_WCK (see CoverPage[3B]), PWM_DIS (see CoverPage[4B]), PWM_EJ (see CoverPage[4B]), PWM_MIX (see CoverPage[3B]), PWM_RS (see CoverPage[3B]), PWM_WCK (see CoverPage[3B])

### Nets
+6V: J16.4(+6V) J17.4(+6V) J20.4(+6V) J21.4(+6V)  [project net VOUT6]
GND: J14.1 J15.1 J16.3(GND) J17.3(GND) J18.1 J19.1 J20.3(GND) J21.3(GND)
ENCA_DIS: J21.5(ENCA) ; port ENCA_DIS
ENCA_EJ: J17.6(ENCB) ; port ENCB_EJ
ENCA_RS: J16.5(ENCA) ; port ENCA_RS
ENCA_WCK: J20.5(ENCA) ; port ENCA_WCK
ENCB_DIS: J21.6(ENCB) ; port ENCB_DIS
ENCB_EJ: J17.5(ENCA) ; port ENCA_EJ
ENCB_RS: J16.6(ENCB) ; port ENCB_RS
ENCB_WCK: J20.6(ENCB) ; port ENCB_WCK
INA_DIS: port INA_DIS, sheet D2/INA
INA_EJ: port INA_EJ, sheet D4/INA
INA_MIX: port INA_MIX, sheet D1/INA
INA_RS: port INA_RS, sheet D5/INA
INA_WCK: port INA_WCK, sheet D3/INA
INB_DIS: port INB_DIS, sheet D2/INB
INB_EJ: port PWM_EJ, sheet D4/PWM
INB_MIX: port INB_MIX, sheet D1/INB
INB_RS: port INB_RS, sheet D5/INB
INB_WCK: port INB_WCK, sheet D3/INB
LS_DIS: J19.2 ; port LS_DIS
LS_EJ: J15.2 ; port LS_EJ
LS_RS: J14.2 ; port LS_RS
LS_WCK: J18.2 ; port LS_WCK
OUTA: J20.2(OUTB) ; sheet D3/OUTA
OUTA: J16.2(OUTB) ; sheet D5/OUTA  [a separate net that carries the same name]
OUTA: J17.2(OUTB) ; sheet D4/OUTA  [a separate net that carries the same name]
OUTA: J21.2(OUTB) ; sheet D2/OUTA  [a separate net that carries the same name]
OUTA: J22.1(OUTA) ; sheet D1/OUTA  [a separate net that carries the same name]
OUTB: J20.1(OUTA) ; sheet D3/OUTB
OUTB: J16.1(OUTA) ; sheet D5/OUTB  [a separate net that carries the same name]
OUTB: J17.1(OUTA) ; sheet D4/OUTB  [a separate net that carries the same name]
OUTB: J21.1(OUTA) ; sheet D2/OUTB  [a separate net that carries the same name]
OUTB: J22.2(OUTB) ; sheet D1/OUTB  [a separate net that carries the same name]
PWM_DIS: port PWM_DIS, sheet D2/PWM
PWM_EJ: port INB_EJ, sheet D4/INB
PWM_MIX: port PWM_MIX, sheet D1/PWM
PWM_RS: port PWM_RS, sheet D5/PWM
PWM_WCK: port PWM_WCK, sheet D3/PWM

### Notes on the sheet
- Raising Motor (with encoder)
- GPIO
- (near J14) Limit switch connector
- Ejection Motor (with encoder)
- (near J15) Limit switch connector
- Pins 3-6 are for encoder
- Wick Placement Motor (with encoder)
- (near J18) Limit switch connector
- Dispensing Motor (with encoder)
- (near J19) Limit switch connector
- Mixing Motor (no encoder)

### Library data of the parts
J14 J15 J18 J19 = CMP-2000-05628-3: as J3 on sheet HEATING; Contact Material: Tin; Temperature Range Low: -40°C; ComponentLink2URL: http://www.molex.com/webdocs/datasheets/pdf/en-us/0530470210_PCB_HEADERS.pdf; Mouser Description: 1.25mm Pitch PicoBlade™ Wire-to-Board Header, Vertical, with Friction Lock, 2 Circuits; Manufacturer Part Number: 53047-0210; Temperature Range High: +85°C; ComponentLink2Description: Datasheet; Automotive: No; RoHS: TRUE; Ambient Temperature Range High: +85°C; Octopart: https://octopart.com/53047-0210-molex-276772; Footprint Url: https://www.molex.com/pdm_docs/sd/530470210_sd.pdf; Lead Free: Yes; Pitch: 1.25mm; Temperature: -40°C to +85°C; Device Class L2: Headers and Wire Housings; Package: 0; Ambient Temperature Range Low: -40°C; Digikey Description: CONN HEADER VERT 2POS 1.25MM; Category: Conn; Device Class L3: unset; Number Of Rows: 1; Device Class L1: Connectors; Height: 4.4mm
J16 J17 J20 J21 = CMP-116-000000-1: Availability: Unavailable; Price: None; Value: *; Pin Count: 6; MP: 2078430006; Component Type: Standard; Design Item ID: 2078430006; Package: None; Source: 2078430006.SchLib
J22 = CMP-002-00086-1: Conn Wire to Board HDR 6 POS 2.5mm Solder ST Top Entry Thru-Hole Bag; MF: Molex; Pins: 2; SnapEDA_Link: https://www.snapeda.com/parts/2078430002/Molex/view-part/?ref=snap; Component Type: Standard; Case/Package: None; Price: None; MP: 2078430002; Source: 2078430002.SchLib; Design Item ID: 2078430002; Availability: In Stock; Purchase-URL: https://pricing.snapeda.com/search/part/2078430002/?ref=eda; Value: *; Check_prices: https://www.snapeda.com/parts/2078430002/Molex/view-part/?ref=eda

## Sheet VNH5019.SchDoc
size A; SheetNumber: 7; SheetTotal: 12
Used 5 times, as channels Designator/D1, Designator/D5, Designator/D4, Designator/D2, Designator/D3. Parts and nets are listed once, with the designators drawn on the sheet.
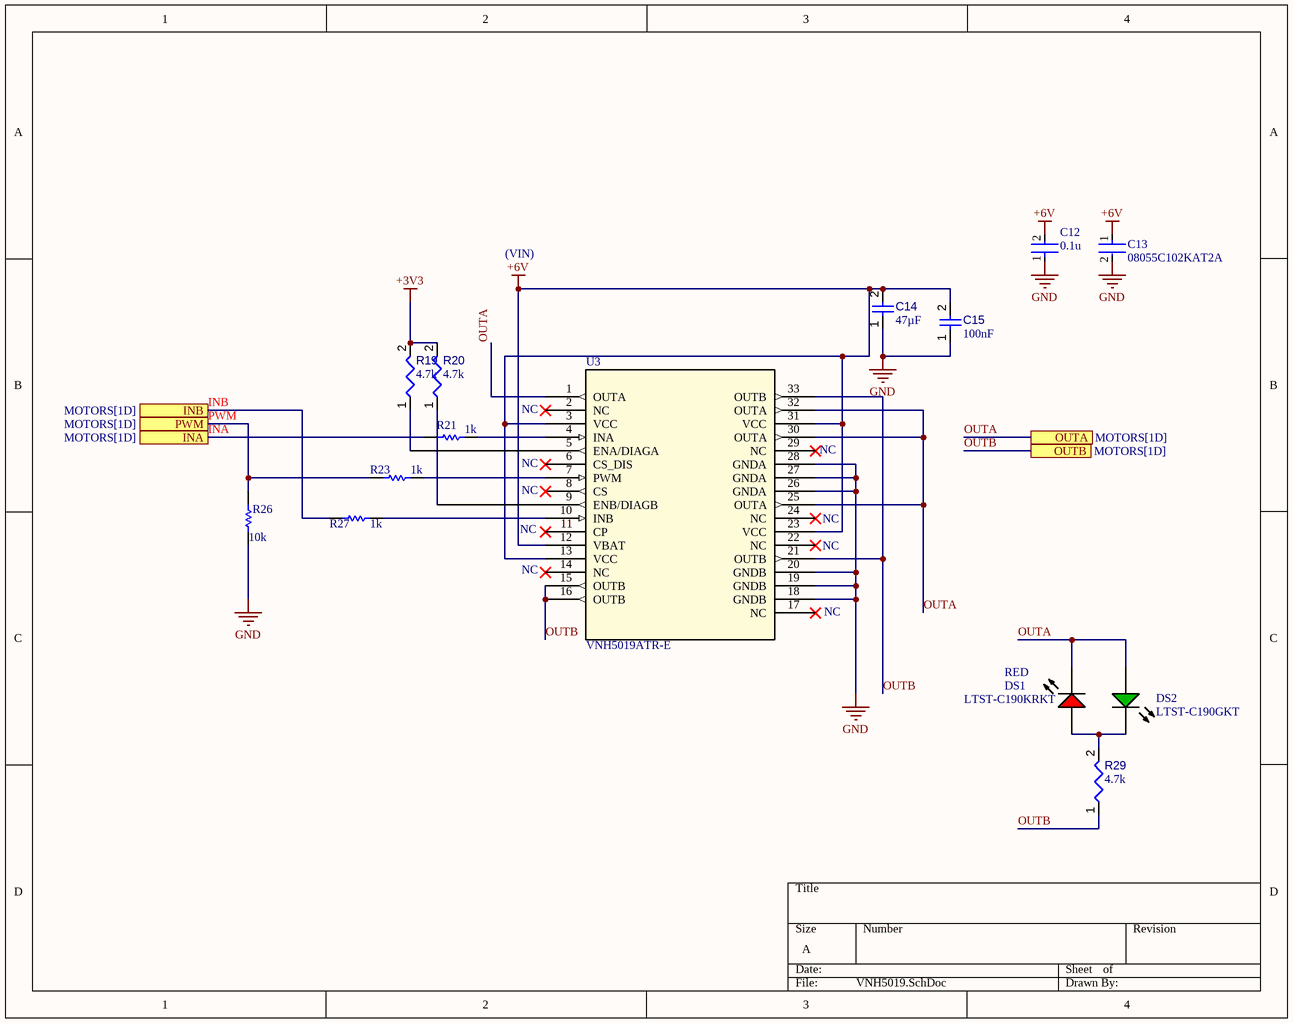
[diagram p4: VNH5019.SchDoc]

### Parts
C12  0.1u  [FP-CL21-IPC_A]
C13  08055C102KAT2A  [FP-0805-L_2_01_0_2-W_1_25-IPC_C]
C14  value 47µF  [CAPC0805(2012)145_L]  (hidden comment: Capacitor 47µF +/-40% 6.3V 0805)
C15  value 100nF  [CAPC2013X95X50LL10T25]  (hidden comment: Capacitor 100 nF +/-10% 50 V 0805)
DS1  LTST-C190KRKT  [LTST-C191KRKT_V]
DS2  LTST-C190GKT  [LTST-C190GKT_V]
R19  value 4.7k  [RESC2013X70X40ML20T20]  (hidden comment: Resistor 4k7 +/-1% 0805 125 mW)
R20  value 4.7k  [RESC2013X70X40ML20T20]  (hidden comment: Resistor 4k7 +/-1% 0805 125 mW)
R21  1k  [RESC2013X60X35ML10T20]
R23  1k  [RESC2013X60X35ML10T20]
R26  10k  [RESC2013X60X40LL20T25_A]
R27  1k  [RESC2013X60X35ML10T20]
R29  value 4.7k  [RESC2013X70X40ML20T20]  (hidden comment: Resistor 4k7 +/-1% 0805 125 mW)
U3  VNH5019ATR-E  [MultiPowerSO-30_STM]

### Ports
INA (see MOTORS[1D]), INB (see MOTORS[1D]), OUTA (see MOTORS[1D]), OUTB (see MOTORS[1D]), PWM (see MOTORS[1D])

### Nets
+3V3: R19.2 R20.2
+6V: C12.2 C13.1 C14.2 C15.2 U3.3(VCC) U3.12(VBAT) U3.13(VCC) U3.23(VCC) U3.31(VCC)
GND: C12.1 C13.2 C14.1 C15.1 R26.1 U3.18(GNDB) U3.19(GNDB) U3.20(GNDB) U3.26(GNDA) U3.27(GNDA) U3.28(GNDA)
INA: R21.2 ; port INA
INB: R27.2 ; port INB
OUTA: DS1.2(K) DS2.1(A) U3.1(OUTA) U3.25(OUTA) U3.30(OUTA) U3.32(OUTA) ; port OUTA
OUTB: R29.1 U3.15(OUTB) U3.16(OUTB) U3.21(OUTB) U3.33(OUTB) ; port OUTB
PWM: R23.2 R26.2 ; port PWM
NetDS1_1: DS1.1(A) DS2.2(K) R29.2
NetR19_1: R19.1 U3.5(ENA/DIAGA)
NetR20_1: R20.1 U3.9(ENB/DIAGB)
NetR21_1: R21.1 U3.4(INA)
NetR23_1: R23.1 U3.7(PWM)
NetR27_1: R27.1 U3.10(INB)

Not connected (* = marked no-connect by the designer): U3 2(NC)* 6(CS_DIS)* 8(CS)* 11(CP)* 14(NC)* 17(NC)* 22(NC)* 24(NC)* 29(NC)*

### Channels
Designator/D1: designators end in _D1; ports INA=INA_MIX INB=INB_MIX OUTA=OUTA OUTB=OUTB PWM=PWM_MIX
Designator/D5: designators end in _D5; ports INA=INA_RS INB=INB_RS OUTA=OUTA OUTB=OUTB PWM=PWM_RS
Designator/D4: designators end in _D4; ports INA=INA_EJ INB=PWM_EJ OUTA=OUTA OUTB=OUTB PWM=INB_EJ
Designator/D2: designators end in _D2; ports INA=INA_DIS INB=INB_DIS OUTA=OUTA OUTB=OUTB PWM=PWM_DIS
Designator/D3: designators end in _D3; ports INA=INA_WCK INB=INB_WCK OUTA=OUTA OUTB=OUTB PWM=PWM_WCK

### Notes on the sheet
- (VIN)
- INA
- PWM
- INB
- NC
- (near U3) NC
- (near DS1) RED

### Library data of the parts
C12 = CMP-13271-000411-1: CL21 Series 0805 100nF 100V ±10% Tolerance X7R Multilayer Ceramic Chip Capacitor
C13 = CMP-1036-02979-3: General Purpose Ceramic Capacitor, 0805, 1nF, 10%, X7R, 0.15, 50V; Dissipation Factor: 2.5%; Insulation Resistance: 100GR; Radiation Hardening: No; Case Code (Imperial): 0805; Packaging: Tape and Reel; Height: 0.94mm; Number of Pins: 2; REACH SVHC: No SVHC; Case Code (Metric): 2012; Voltage: 50V; Max Operating Temperature: 125°C; Tolerance: 10%; Voltage Rating: 50V; Depth: 1.25mm; Voltage Rating (DC): 50V; Thickness: 0.037inch; Termination: SMD/SMT; Package Quantity: 1; RoHS Compliant: Yes; Mount: Surface Mount; Dielectric: X7R; Length: 2.01mm; Contact Plating: Tin; Lead Free: Lead Free; Case/Package: 0805; Width: 1.25mm; Capacitance: 1nF; Dielectric Material: Ceramic; Min Operating Temperature: -55°C
C14 = CMP-001-00082-4: Chip Capacitor, 47µF +/-40%, 6.3V, 0805, Thickness 1.45 mm; Tolerance: 10%; Min Operating Temperature: -55°C; Max Operating Temperature: 85°C; Case/Package: 0805; Pins: 2; Mounting Technology: SMT; Voltage Rating: 6.3V
C15 = CMP-001-00018-6: Chip Capacitor, 100 nF, +/- 10%, 50 V, 0805 (2012 Metric); Capacitor Type: Ceramic; Voltage Rating: 50V; Pins: 2; Max Operating Temperature: 125°C; Min Operating Temperature: -55°C; Mounting Technology: SM; Case/Package: 0805; RoHS Compliant: True; Tolerance: 10%
DS1 = CMP-007-00024-2: LED Uni-Color Red, 62.5 mW, 25 mA, -30 to 85 degC, 2-Pin SMD, RoHS, Tape and Reel; Manufacturer: Lite-On; Power: 75mW; Forward Voltage: 2V; Luminous Intensity: 54mcd; Lens Style: Diffused; Viewing Angle: 130degrees; Forward Current: 20mA; Manufacturer URL: http://www.us.liteon.com/; Case/Package: 0603; Datasheet Version: Rev. F, 05/2013; Package Reference: C191KRKT; Datasheet URL: http://optoelectronics.liteon.com/upload/download/DS-22-99-0151/S_110_LTST-C190KRKT.pdf; Package Description: 2-Pin Surface Mount Device, Body 1.6 x 0.8 mm; Nominal Vf: 2V; Packaging: TapeandReel; RoHS Compliant: True; Pins: 2; Illumination Colour: Red; Colour: Red; Mounting Technology: SM; Package Quantity: 3000; Min Operating Temperature: -55°C; Max Operating Temperature: 85°C
DS2 = CMP-007-00022-2: LED Uni-Color Green, 100 mW, 30 mA, -55 to 85 degC, 2-Pin SMD, RoHS, Tape and Reel; Manufacturer: Lite-On; Power: 100mW; Forward Voltage: 2.1V; Viewing Angle: 130degrees; Forward Current: 20mA; Luminous Intensity: 6mcd; Lens Style: Clear; Manufacturer URL: http://www.us.liteon.com/; RoHS Compliant: True; Colour: Green; Package Description: 2-Pin Surface Mount Device, Body 1.6 x 0.8 mm; Datasheet URL: http://datasheet.octopart.com/LTST-C190GKT-Lite-On-datasheet-158530.pdf; Datasheet Version: Dec-06; Mounting Technology: SM; Case/Package: 0603; Package Reference: C190GKT; Packaging: TapeandReel; Min Operating Temperature: -55°C; Nominal Vf: 2.1V; Package Quantity: 3000; Illumination Colour: Green; Max Operating Temperature: 85°C; Pins: 2
R19 R20 R29 = CMP-009-00032-5: Chip Resistor, 4.7 KOhm, +/- 1%, 0.125 W, -55 to 155 degC, 0805 (2012 Metric); Power: 125mW; Voltage Rating: 150V; Max Operating Temperature: 155°C; Min Operating Temperature: -55°C; Case/Package: 0805; RoHS Compliant: True; Pins: 2; Tolerance: 1%; Mounting Technology: SM
R21 R23 R27 = CMP-2100-03671-1: as R5 on sheet MCU; Number of Pins: 2; Number of Terminations: 2; Datasheet URL: http://www.yageo.com/NewPortal/yageodocoutput?fileName=/pdf/R-Chip/PYu-RC_Group_51_RoHS_L_5.pdf; Length: 0.079inch; Package Description: 2-Pin Surface Mounted Device, Body 2 x 1.25 mm; Depth: 1.25mm; Height: 0.024inch; Military Standard: Not; Case/Package: 0805; Package Reference: 0805; RoHSCompliant: true; Lead Free: LeadFree; Packaging: TapeandReel; Package Quantity: 1; Datasheet Version: Rev. 5, 10/2016; Tolerance: 1%; Min Operating Temperature: -55degC; Voltage Rating: 150V; Composition: ThickFilm; Case Code (Imperial): 0805; Power Rating: 125mW; Width: 0.049inch; Case Code (Metric): 2012; Manufacturer URL: http://www.yageo.com/; Max Operating Temperature: 155degC; REACH SVHC: Unknown; Termination: SMD/SMT
R26 = CMP-2001-00582-2: as R8 on sheet MCU; Product Category: ThinFilmResistors-SMD; Datasheet Version: 02/2016; Operating Temperature Range: -55Cto+155C; Length: 2mm; Mounting Technology: SurfaceMount; Manufacturer URL: http://www.panasonic.com/; Width: 1.25mm; Packaging: Reel; Product: ThinFilmResistorsSMD; Package / Case: 0805(2012metric); Termination Style: SMD/SMT; Tolerance: 0.1%; Datasheet URL: https://industrial.panasonic.com/cdbs/www-data/pdf/RDM0000/AOA0000C307.pdf; Package Description: 2-Pin Surface Mount Device, Body 2 x 1.25 mm; Factory Pack Quantity: 5000; Series: ERA-6A; Case Code - mm: 2012; RoHS: Details; Package Reference: 0805; Height: 0.5mm; Manufacturer: Panasonic; Case Code - in: 0805; Type: MetalFilmChipResistors
U3 = CMP-120-000003-2: No Description Available; Mfr_Name: STMicroelectronics; Design Item ID: VNH5019ATR-E; Type: Type; Source: VNH5019ATR-E.SchLib; RefDes: RefDes; Pin Count: 33; Component Type: Standard

## Sheet COOLING.SchDoc
size A; SheetNumber: 5; SheetTotal: 12
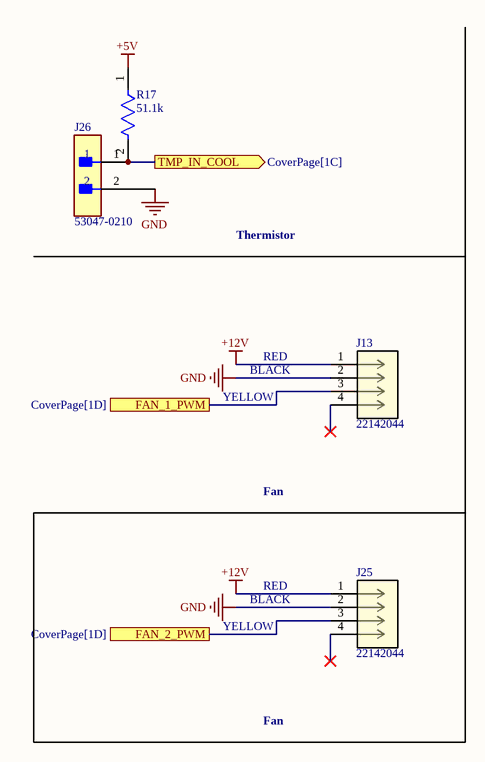
[diagram p5: COOLING.SchDoc]

### Parts
J13  22142044  [CONN_SDA-4455_04_BE_MOL]
J25  22142044  [CONN_SDA-4455_04_BE_MOL]
J26  53047-0210  [FP-53047-0210-MFG]
R17  51.1k  [FP-RG2012-MFG]

### Ports
FAN_1_PWM (see CoverPage[1D]), FAN_2_PWM (see CoverPage[1D]), TMP_IN_COOL (out, see CoverPage[1C])

### Nets
+5V: R17.1
+12V: J13.1 J25.1  [project net VOUT12]
GND: J13.2 J25.2 J26.2
FAN_1_PWM: J13.3 ; port FAN_1_PWM
FAN_2_PWM: J25.3 ; port FAN_2_PWM
TMP_IN_COOL: J26.1 R17.2 ; port TMP_IN_COOL

Not connected (* = marked no-connect by the designer): J13 4*; J25 4*

### Notes on the sheet
- Thermistor
- RED
- YELLOW
- BLACK
- Fan

### Library data of the parts
J13 J25 = CMP-129-000000-1: No Description Available; Mfr_Name: Molex Connector Corporation; Design Item ID: 22142044; Type: Type; RefDes: RefDes; Source: 22142044.SchLib
J26 = CMP-2000-05628-3: as J3 on sheet HEATING; Contact Material: Tin; Temperature Range Low: -40°C; ComponentLink2URL: http://www.molex.com/webdocs/datasheets/pdf/en-us/0530470210_PCB_HEADERS.pdf; Mouser Description: 1.25mm Pitch PicoBlade™ Wire-to-Board Header, Vertical, with Friction Lock, 2 Circuits; Manufacturer Part Number: 53047-0210; Temperature Range High: +85°C; ComponentLink2Description: Datasheet; Automotive: No; RoHS: TRUE; Ambient Temperature Range High: +85°C; Octopart: https://octopart.com/53047-0210-molex-276772; Footprint Url: https://www.molex.com/pdm_docs/sd/530470210_sd.pdf; Lead Free: Yes; Pitch: 1.25mm; Temperature: -40°C to +85°C; Device Class L2: Headers and Wire Housings; Package: 0; Ambient Temperature Range Low: -40°C; Digikey Description: CONN HEADER VERT 2POS 1.25MM; Category: Conn; Device Class L3: unset; Number Of Rows: 1; Device Class L1: Connectors; Height: 4.4mm
R17 = CMP-2001-03008-2: as R3 on sheet HEATING; Number of Terminations: 2; Case Code (Imperial): 0805; Height: 0.02inch; Min Operating Temperature: -55°C; Voltage Rating: 150V; Length: 0.079inch; Lead Free: Lead Free; Resistor Type: Thin Film; Tolerance: 0.1%; Weight: 0.000194oz; Termination: SMD/SMT; Max Power Dissipation: 125mW; Packaging: Tape and Reel; Width: 1.2mm; Series: RG; Max Operating Temperature: 155°C; Case/Package: 0805; Temperature Coefficient: 25ppm/°C; Package Quantity: 1; Case Code (Metric): 2012; RoHS Compliant: Yes; Voltage Rating (DC): 150V; Features: Automotive AEC-Q200